# Altium project 新zynq底板.PrjPcb (part 2 of 2)

## Sheet 07_ZYNQ_CAMERALINK.SchDoc
size 420 x 296 mm; SheetNumber: 7; SheetTotal: 7
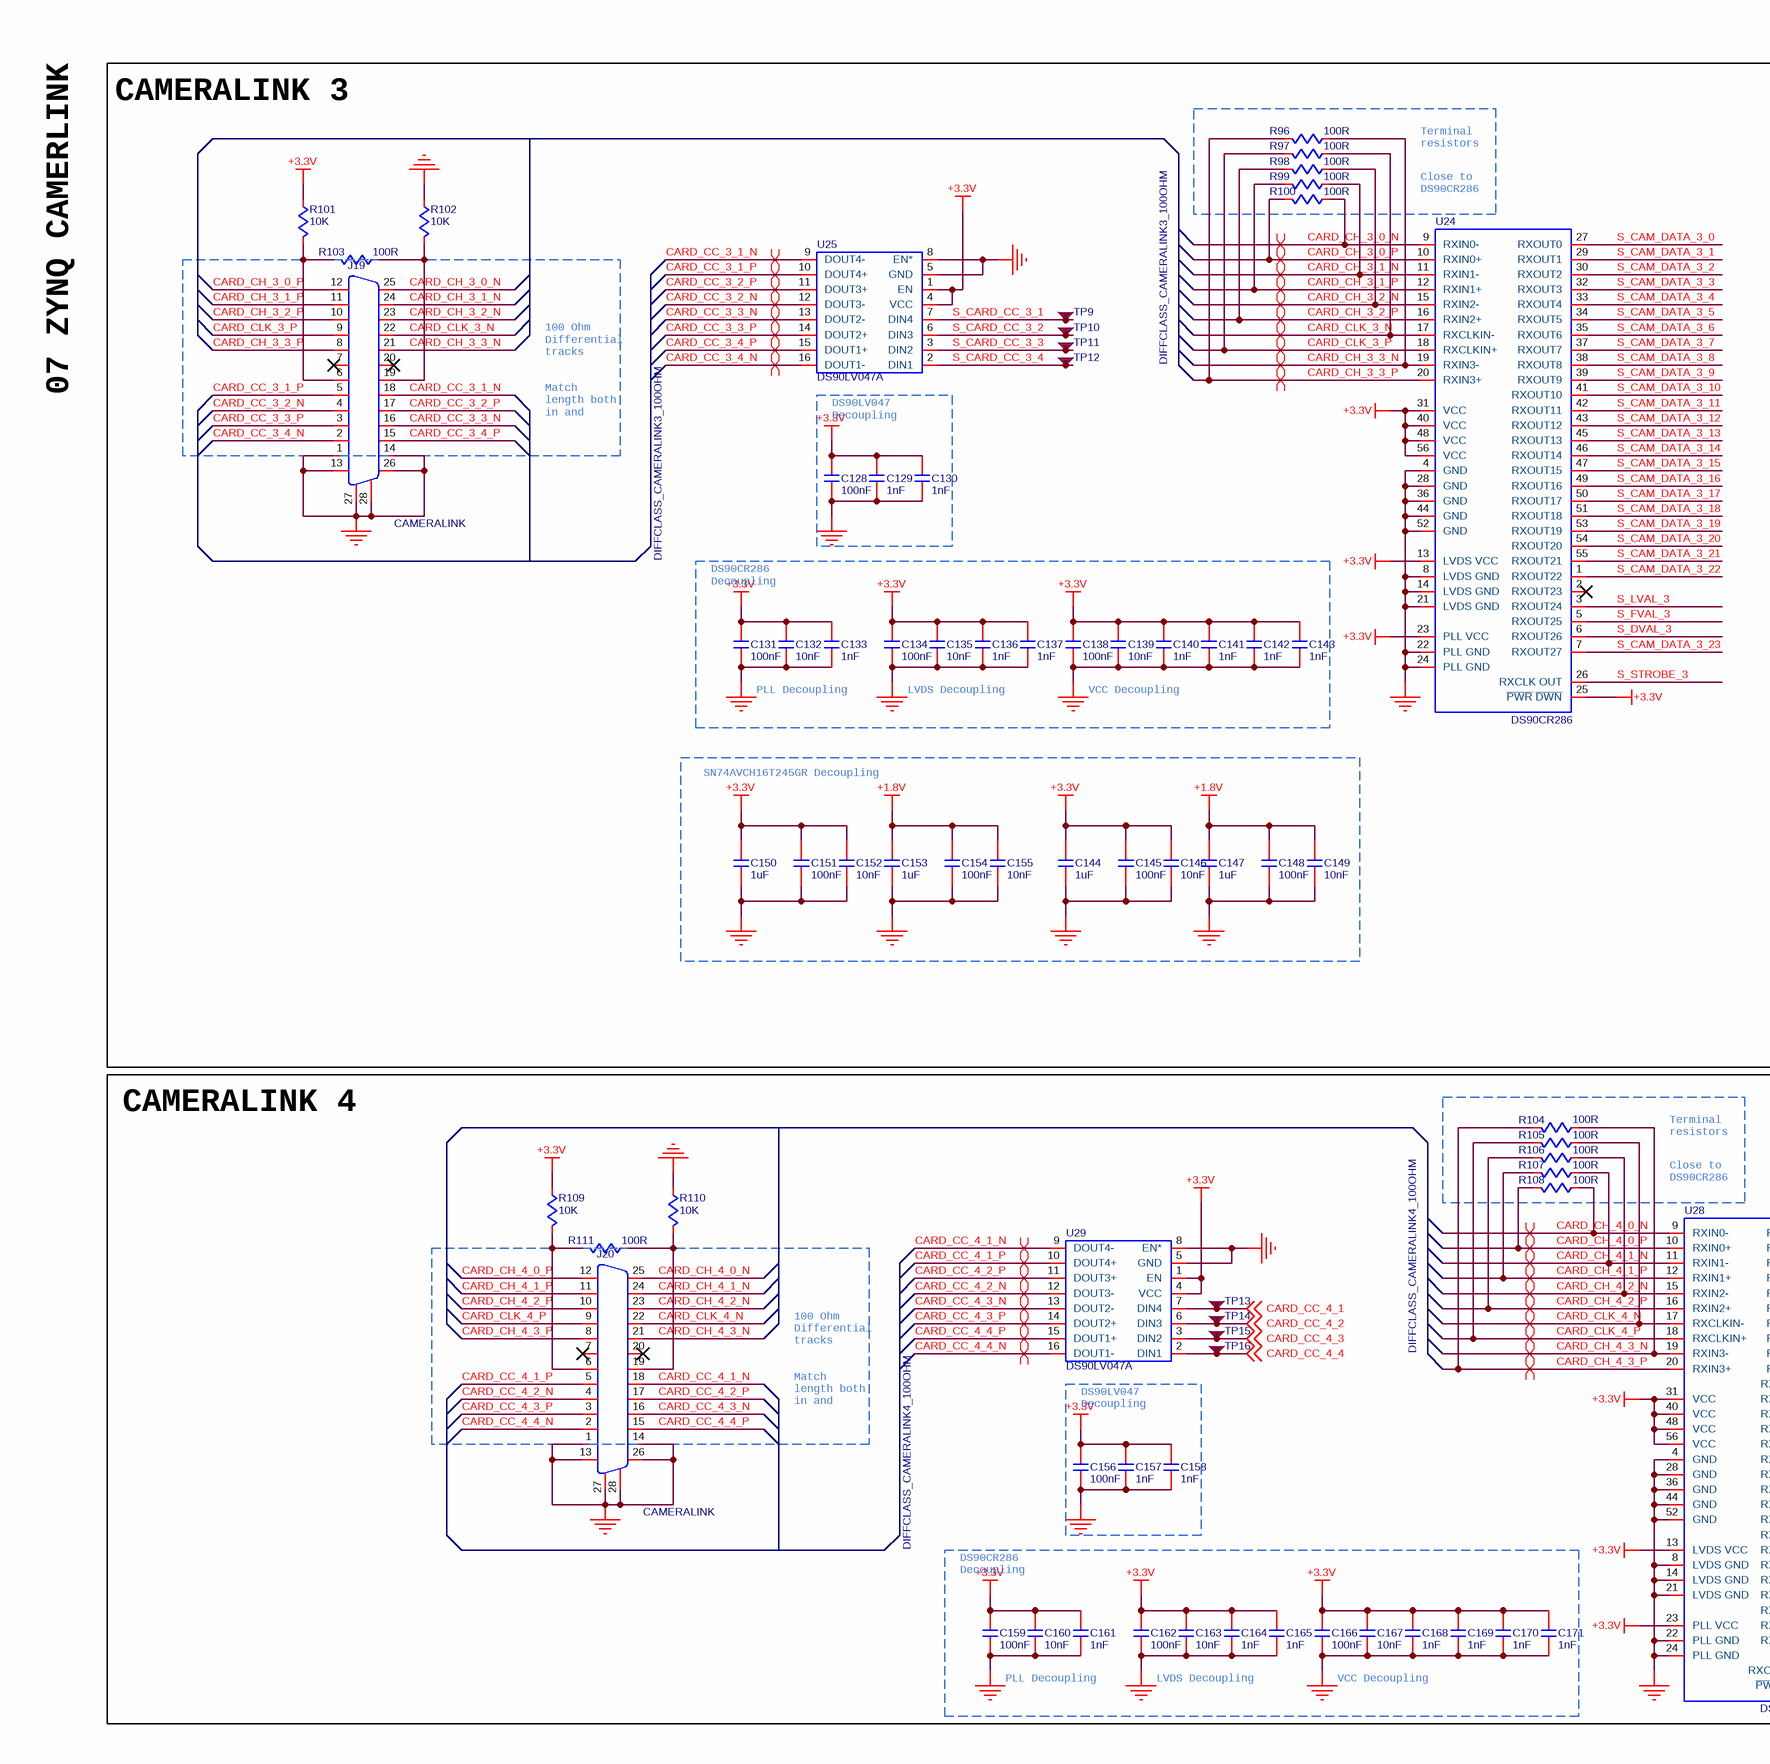
[diagram p10: 07_ZYNQ_CAMERALINK.SchDoc, left]
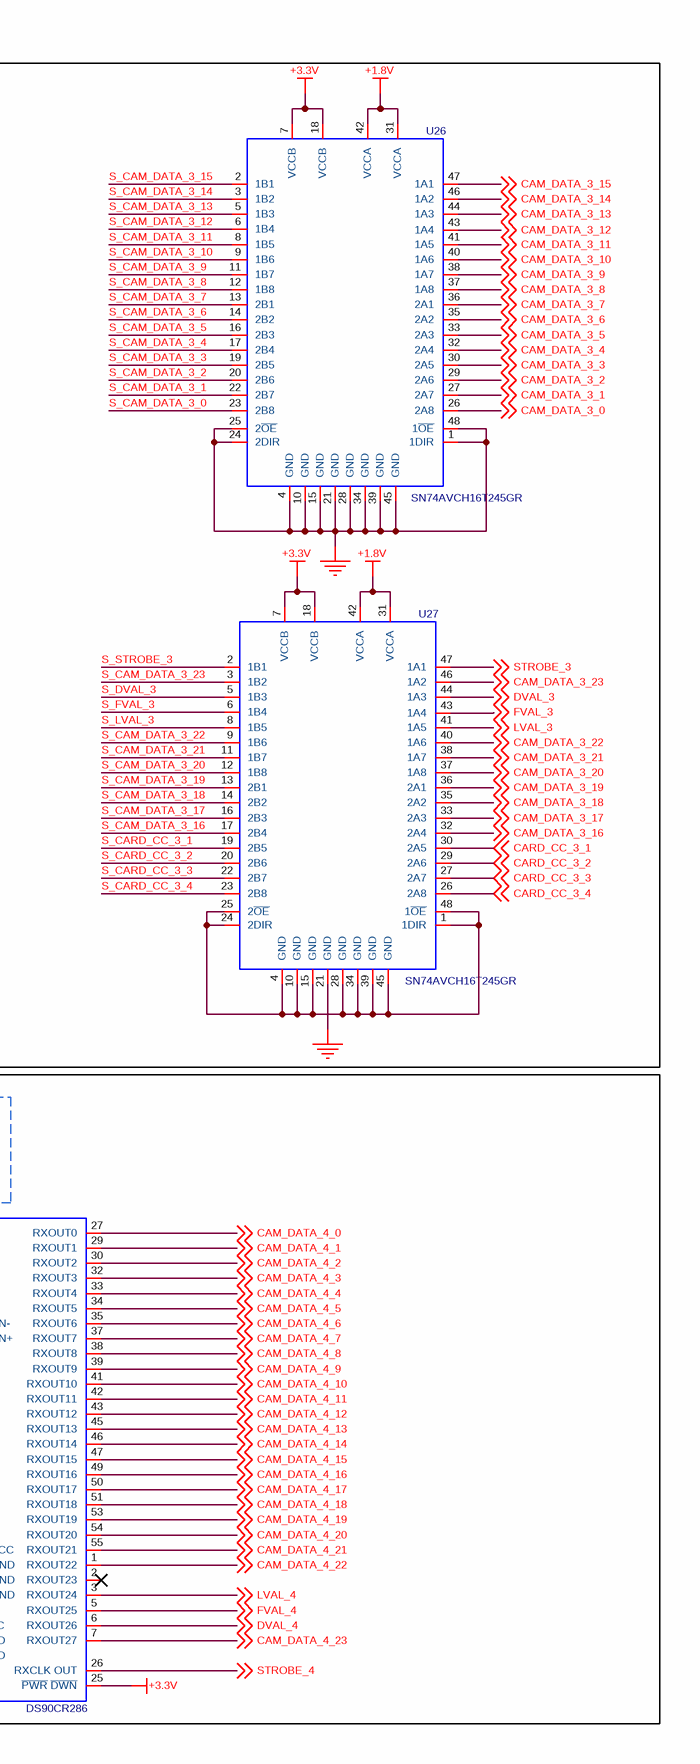
[diagram p11: 07_ZYNQ_CAMERALINK.SchDoc, right]

### Parts
C128  value 100nF  [C0402]  (hidden comment: C-NOMO)
C129  value 1nF  [C0402]  (hidden comment: C-NOMO)
C130  value 1nF  [C0402]  (hidden comment: C-NOMO)
C131  value 100nF  [C0402]  (hidden comment: C-NOMO)
C132  value 10nF  [C0402]  (hidden comment: C-NOMO)
C133  value 1nF  [C0402]  (hidden comment: C-NOMO)
C134  value 100nF  [C0402]  (hidden comment: C-NOMO)
C135  value 10nF  [C0402]  (hidden comment: C-NOMO)
C136  value 1nF  [C0402]  (hidden comment: C-NOMO)
C137  value 1nF  [C0402]  (hidden comment: C-NOMO)
C138  value 100nF  [C0402]  (hidden comment: C-NOMO)
C139  value 10nF  [C0402]  (hidden comment: C-NOMO)
C140  value 1nF  [C0402]  (hidden comment: C-NOMO)
C141  value 1nF  [C0402]  (hidden comment: C-NOMO)
C142  value 1nF  [C0402]  (hidden comment: C-NOMO)
C143  value 1nF  [C0402]  (hidden comment: C-NOMO)
C144  value 1uF  [C0402]  (hidden comment: C-NOMO)
C145  value 100nF  [C0402]  (hidden comment: C-NOMO)
C146  value 10nF  [C0402]  (hidden comment: C-NOMO)
C147  value 1uF  [C0402]  (hidden comment: C-NOMO)
C148  value 100nF  [C0402]  (hidden comment: C-NOMO)
C149  value 10nF  [C0402]  (hidden comment: C-NOMO)
C150  value 1uF  [C0402]  (hidden comment: C-NOMO)
C151  value 100nF  [C0402]  (hidden comment: C-NOMO)
C152  value 10nF  [C0402]  (hidden comment: C-NOMO)
C153  value 1uF  [C0402]  (hidden comment: C-NOMO)
C154  value 100nF  [C0402]  (hidden comment: C-NOMO)
C155  value 10nF  [C0402]  (hidden comment: C-NOMO)
C156  value 100nF  [C0402]  (hidden comment: C-NOMO)
C157  value 1nF  [C0402]  (hidden comment: C-NOMO)
C158  value 1nF  [C0402]  (hidden comment: C-NOMO)
C159  value 100nF  [C0402]  (hidden comment: C-NOMO)
C160  value 10nF  [C0402]  (hidden comment: C-NOMO)
C161  value 1nF  [C0402]  (hidden comment: C-NOMO)
C162  value 100nF  [C0402]  (hidden comment: C-NOMO)
C163  value 10nF  [C0402]  (hidden comment: C-NOMO)
C164  value 1nF  [C0402]  (hidden comment: C-NOMO)
C165  value 1nF  [C0402]  (hidden comment: C-NOMO)
C166  value 100nF  [C0402]  (hidden comment: C-NOMO)
C167  value 10nF  [C0402]  (hidden comment: C-NOMO)
C168  value 1nF  [C0402]  (hidden comment: C-NOMO)
C169  value 1nF  [C0402]  (hidden comment: C-NOMO)
C170  value 1nF  [C0402]  (hidden comment: C-NOMO)
C171  value 1nF  [C0402]  (hidden comment: C-NOMO)
J19  CAMERALINK  [CAMERALINK]
J20  CAMERALINK  [CAMERALINK]
R96  value 100R  [R0402]  (hidden comment: R)
R97  value 100R  [R0402]  (hidden comment: R)
R98  value 100R  [R0402]  (hidden comment: R)
R99  value 100R  [R0402]  (hidden comment: R)
R100  value 100R  [R0402]  (hidden comment: R)
R101  value 10K  [R0402]  (hidden comment: R)
R102  value 10K  [R0402]  (hidden comment: R)
R103  value 100R  [R0402]  (hidden comment: R)
R104  value 100R  [R0402]  (hidden comment: R)
R105  value 100R  [R0402]  (hidden comment: R)
R106  value 100R  [R0402]  (hidden comment: R)
R107  value 100R  [R0402]  (hidden comment: R)
R108  value 100R  [R0402]  (hidden comment: R)
R109  value 10K  [R0402]  (hidden comment: R)
R110  value 10K  [R0402]  (hidden comment: R)
R111  value 100R  [R0402]  (hidden comment: R)
TP9  TP  [TP]  (value not drawn)
TP10  TP  [TP]  (value not drawn)
TP11  TP  [TP]  (value not drawn)
TP12  TP  [TP]  (value not drawn)
TP13  TP  [TP]  (value not drawn)
TP14  TP  [TP]  (value not drawn)
TP15  TP  [TP]  (value not drawn)
TP16  TP  [TP]  (value not drawn)
U24  DS90CR286  [DS90CR286]
U25  DS90LV047A  [DS90LV047]
U26  SN74AVCH16T245GR  [SN74AVCH16T245GR]
U27  SN74AVCH16T245GR  [SN74AVCH16T245GR]
U28  DS90CR286  [DS90CR286]
U29  DS90LV047A  [DS90LV047]

### Blocks framed on the sheet
CAMERALINK 3: C128-C155 J19 R96-R103 TP9-TP12 U24-U27
CAMERALINK 4: C156-C171 J20 R104-R111 TP13-TP16 U28 U29

### Nets
+1.8V: C147.2 C148.2 C149.2 C153.2 C154.2 C155.2 U26.31(VCCA) U26.42(VCCA) U27.31(VCCA) U27.42(VCCA)
+3.3V: C128.2 C129.2 C130.2 C131.2 C132.2 C133.2 C134.2 C135.2 C136.2 C137.2 C138.2 C139.2 C140.2 C141.2 C142.2 C143.2 C144.2 C145.2 C146.2 C150.2 C151.2 C152.2 C156.2 C157.2 C158.2 C159.2 C160.2 C161.2 C162.2 C163.2 C164.2 C165.2 C166.2 C167.2 C168.2 C169.2 C170.2 C171.2 R101.2 R109.2 U24.13(LVDS_VCC) U24.23(PLL_VCC) U24.25(~{PWR}_~{DWN}) U24.31(VCC) U24.40(VCC) U24.48(VCC) U24.56(VCC) U25.1(EN) U25.4(VCC) U26.7(VCCB) U26.18(VCCB) U27.7(VCCB) U27.18(VCCB) U28.13(LVDS_VCC) U28.23(PLL_VCC) U28.25(~{PWR}_~{DWN}) U28.31(VCC) U28.40(VCC) U28.48(VCC) U28.56(VCC) U29.1(EN) U29.4(VCC)
GND: C128.1 C129.1 C130.1 C131.1 C132.1 C133.1 C134.1 C135.1 C136.1 C137.1 C138.1 C139.1 C140.1 C141.1 C142.1 C143.1 C144.1 C145.1 C146.1 C147.1 C148.1 C149.1 C150.1 C151.1 C152.1 C153.1 C154.1 C155.1 C156.1 C157.1 C158.1 C159.1 C160.1 C161.1 C162.1 C163.1 C164.1 C165.1 C166.1 C167.1 C168.1 C169.1 C170.1 C171.1 J19.1 J19.13 J19.14 J19.26 J19.27 J19.28 J20.1 J20.13 J20.14 J20.26 J20.27 J20.28 R102.2 R110.2 U24.4(GND) U24.8(LVDS_GND) U24.14(LVDS_GND) U24.21(LVDS_GND) U24.22(PLL_GND) U24.24(PLL_GND) U24.28(GND) U24.36(GND) U24.44(GND) U24.52(GND) U25.5(GND) U25.8(EN*) U26.1(1DIR) U26.4(GND) U26.10(GND) U26.15(GND) U26.21(GND) U26.24(2DIR) U26.25(2~{OE}) U26.28(GND) U26.34(GND) U26.39(GND) U26.45(GND) U26.48(1~{OE}) U27.21(GND) U28.4(GND) U28.8(LVDS_GND) U28.14(LVDS_GND) U28.21(LVDS_GND) U28.22(PLL_GND) U28.24(PLL_GND) U28.28(GND) U28.36(GND) U28.44(GND) U28.52(GND) U29.5(GND) U29.8(EN*)
CAM_DATA_3_0: U26.26(2A8) ; off-sheet CAM_DATA_3_0
CAM_DATA_3_1: U26.27(2A7) ; off-sheet CAM_DATA_3_1
CAM_DATA_3_2: U26.29(2A6) ; off-sheet CAM_DATA_3_2
CAM_DATA_3_3: U26.30(2A5) ; off-sheet CAM_DATA_3_3
CAM_DATA_3_4: U26.32(2A4) ; off-sheet CAM_DATA_3_4
CAM_DATA_3_5: U26.33(2A3) ; off-sheet CAM_DATA_3_5
CAM_DATA_3_6: U26.35(2A2) ; off-sheet CAM_DATA_3_6
CAM_DATA_3_7: U26.36(2A1) ; off-sheet CAM_DATA_3_7
CAM_DATA_3_8: U26.37(1A8) ; off-sheet CAM_DATA_3_8
CAM_DATA_3_9: U26.38(1A7) ; off-sheet CAM_DATA_3_9
CAM_DATA_3_10: U26.40(1A6) ; off-sheet CAM_DATA_3_10
CAM_DATA_3_11: U26.41(1A5) ; off-sheet CAM_DATA_3_11
CAM_DATA_3_12: U26.43(1A4) ; off-sheet CAM_DATA_3_12
CAM_DATA_3_13: U26.44(1A3) ; off-sheet CAM_DATA_3_13
CAM_DATA_3_14: U26.46(1A2) ; off-sheet CAM_DATA_3_14
CAM_DATA_3_15: U26.47(1A1) ; off-sheet CAM_DATA_3_15
CAM_DATA_3_16: U27.32(2A4) ; off-sheet CAM_DATA_3_16
CAM_DATA_3_17: U27.33(2A3) ; off-sheet CAM_DATA_3_17
CAM_DATA_3_18: U27.35(2A2) ; off-sheet CAM_DATA_3_18
CAM_DATA_3_19: U27.36(2A1) ; off-sheet CAM_DATA_3_19
CAM_DATA_3_20: U27.37(1A8) ; off-sheet CAM_DATA_3_20
CAM_DATA_3_21: U27.38(1A7) ; off-sheet CAM_DATA_3_21
CAM_DATA_3_22: U27.40(1A6) ; off-sheet CAM_DATA_3_22
CAM_DATA_3_23: U27.46(1A2) ; off-sheet CAM_DATA_3_23
CAM_DATA_4_0: U28.27(RXOUT0) ; off-sheet CAM_DATA_4_0
CAM_DATA_4_1: U28.29(RXOUT1) ; off-sheet CAM_DATA_4_1
CAM_DATA_4_2: U28.30(RXOUT2) ; off-sheet CAM_DATA_4_2
CAM_DATA_4_3: U28.32(RXOUT3) ; off-sheet CAM_DATA_4_3
CAM_DATA_4_4: U28.33(RXOUT4) ; off-sheet CAM_DATA_4_4
CAM_DATA_4_5: U28.34(RXOUT5) ; off-sheet CAM_DATA_4_5
CAM_DATA_4_6: U28.35(RXOUT6) ; off-sheet CAM_DATA_4_6
CAM_DATA_4_7: U28.37(RXOUT7) ; off-sheet CAM_DATA_4_7
CAM_DATA_4_8: U28.38(RXOUT8) ; off-sheet CAM_DATA_4_8
CAM_DATA_4_9: U28.39(RXOUT9) ; off-sheet CAM_DATA_4_9
CAM_DATA_4_10: U28.41(RXOUT10) ; off-sheet CAM_DATA_4_10
CAM_DATA_4_11: U28.42(RXOUT11) ; off-sheet CAM_DATA_4_11
CAM_DATA_4_12: U28.43(RXOUT12) ; off-sheet CAM_DATA_4_12
CAM_DATA_4_13: U28.45(RXOUT13) ; off-sheet CAM_DATA_4_13
CAM_DATA_4_14: U28.46(RXOUT14) ; off-sheet CAM_DATA_4_14
CAM_DATA_4_15: U28.47(RXOUT15) ; off-sheet CAM_DATA_4_15
CAM_DATA_4_16: U28.49(RXOUT16) ; off-sheet CAM_DATA_4_16
CAM_DATA_4_17: U28.50(RXOUT17) ; off-sheet CAM_DATA_4_17
CAM_DATA_4_18: U28.51(RXOUT18) ; off-sheet CAM_DATA_4_18
CAM_DATA_4_19: U28.53(RXOUT19) ; off-sheet CAM_DATA_4_19
CAM_DATA_4_20: U28.54(RXOUT20) ; off-sheet CAM_DATA_4_20
CAM_DATA_4_21: U28.55(RXOUT21) ; off-sheet CAM_DATA_4_21
CAM_DATA_4_22: U28.1(RXOUT22) ; off-sheet CAM_DATA_4_22
CAM_DATA_4_23: U28.7(RXOUT27) ; off-sheet CAM_DATA_4_23
CARD_CC_3_1: U27.30(2A5) ; off-sheet CARD_CC_3_1
CARD_CC_3_1_N: J19.18 U25.9(DOUT4-)
CARD_CC_3_1_P: J19.5 U25.10(DOUT4+)
CARD_CC_3_2: U27.29(2A6) ; off-sheet CARD_CC_3_2
CARD_CC_3_2_N: J19.4 U25.12(DOUT3-)
CARD_CC_3_2_P: J19.17 U25.11(DOUT3+)
CARD_CC_3_3: U27.27(2A7) ; off-sheet CARD_CC_3_3
CARD_CC_3_3_N: J19.16 U25.13(DOUT2-)
CARD_CC_3_3_P: J19.3 U25.14(DOUT2+)
CARD_CC_3_4: U27.26(2A8) ; off-sheet CARD_CC_3_4
CARD_CC_3_4_N: J19.2 U25.16(DOUT1-)
CARD_CC_3_4_P: J19.15 U25.15(DOUT1+)
CARD_CC_4_1: TP13.0 U29.7(DIN4) ; off-sheet CARD_CC_4_1
CARD_CC_4_1_N: J20.18 U29.9(DOUT4-)
CARD_CC_4_1_P: J20.5 U29.10(DOUT4+)
CARD_CC_4_2: TP14.0 U29.6(DIN3) ; off-sheet CARD_CC_4_2
CARD_CC_4_2_N: J20.4 U29.12(DOUT3-)
CARD_CC_4_2_P: J20.17 U29.11(DOUT3+)
CARD_CC_4_3: TP15.0 U29.3(DIN2) ; off-sheet CARD_CC_4_3
CARD_CC_4_3_N: J20.16 U29.13(DOUT2-)
CARD_CC_4_3_P: J20.3 U29.14(DOUT2+)
CARD_CC_4_4: TP16.0 U29.2(DIN1) ; off-sheet CARD_CC_4_4
CARD_CC_4_4_N: J20.2 U29.16(DOUT1-)
CARD_CC_4_4_P: J20.15 U29.15(DOUT1+)
CARD_CH_3_0_N: J19.25 R100.2 U24.9(RXIN0-)
CARD_CH_3_0_P: J19.12 R100.1 U24.10(RXIN0+)
CARD_CH_3_1_N: J19.24 R99.2 U24.11(RXIN1-)
CARD_CH_3_1_P: J19.11 R99.1 U24.12(RXIN1+)
CARD_CH_3_2_N: J19.23 R98.2 U24.15(RXIN2-)
CARD_CH_3_2_P: J19.10 R98.1 U24.16(RXIN2+)
CARD_CH_3_3_N: J19.21 R96.2 U24.19(RXIN3-)
CARD_CH_3_3_P: J19.8 R96.1 U24.20(RXIN3+)
CARD_CH_4_0_N: J20.25 R108.2 U28.9(RXIN0-)
CARD_CH_4_0_P: J20.12 R108.1 U28.10(RXIN0+)
CARD_CH_4_1_N: J20.24 R107.2 U28.11(RXIN1-)
CARD_CH_4_1_P: J20.11 R107.1 U28.12(RXIN1+)
CARD_CH_4_2_N: J20.23 R106.2 U28.15(RXIN2-)
CARD_CH_4_2_P: J20.10 R106.1 U28.16(RXIN2+)
CARD_CH_4_3_N: J20.21 R104.2 U28.19(RXIN3-)
CARD_CH_4_3_P: J20.8 R104.1 U28.20(RXIN3+)
CARD_CLK_3_N: J19.22 R97.2 U24.17(RXCLKIN-)
CARD_CLK_3_P: J19.9 R97.1 U24.18(RXCLKIN+)
CARD_CLK_4_N: J20.22 R105.2 U28.17(RXCLKIN-)
CARD_CLK_4_P: J20.9 R105.1 U28.18(RXCLKIN+)
DVAL_3: U27.44(1A3) ; off-sheet DVAL_3
DVAL_4: U28.6(RXOUT26) ; off-sheet DVAL_4
FVAL_3: U27.43(1A4) ; off-sheet FVAL_3
FVAL_4: U28.5(RXOUT25) ; off-sheet FVAL_4
LVAL_3: U27.41(1A5) ; off-sheet LVAL_3
LVAL_4: U28.3(RXOUT24) ; off-sheet LVAL_4
S_CAM_DATA_3_0: U24.27(RXOUT0) U26.23(2B8)
S_CAM_DATA_3_1: U24.29(RXOUT1) U26.22(2B7)
S_CAM_DATA_3_2: U24.30(RXOUT2) U26.20(2B6)
S_CAM_DATA_3_3: U24.32(RXOUT3) U26.19(2B5)
S_CAM_DATA_3_4: U24.33(RXOUT4) U26.17(2B4)
S_CAM_DATA_3_5: U24.34(RXOUT5) U26.16(2B3)
S_CAM_DATA_3_6: U24.35(RXOUT6) U26.14(2B2)
S_CAM_DATA_3_7: U24.37(RXOUT7) U26.13(2B1)
S_CAM_DATA_3_8: U24.38(RXOUT8) U26.12(1B8)
S_CAM_DATA_3_9: U24.39(RXOUT9) U26.11(1B7)
S_CAM_DATA_3_10: U24.41(RXOUT10) U26.9(1B6)
S_CAM_DATA_3_11: U24.42(RXOUT11) U26.8(1B5)
S_CAM_DATA_3_12: U24.43(RXOUT12) U26.6(1B4)
S_CAM_DATA_3_13: U24.45(RXOUT13) U26.5(1B3)
S_CAM_DATA_3_14: U24.46(RXOUT14) U26.3(1B2)
S_CAM_DATA_3_15: U24.47(RXOUT15) U26.2(1B1)
S_CAM_DATA_3_16: U24.49(RXOUT16) U27.17(2B4)
S_CAM_DATA_3_17: U24.50(RXOUT17) U27.16(2B3)
S_CAM_DATA_3_18: U24.51(RXOUT18) U27.14(2B2)
S_CAM_DATA_3_19: U24.53(RXOUT19) U27.13(2B1)
S_CAM_DATA_3_20: U24.54(RXOUT20) U27.12(1B8)
S_CAM_DATA_3_21: U24.55(RXOUT21) U27.11(1B7)
S_CAM_DATA_3_22: U24.1(RXOUT22) U27.9(1B6)
S_CAM_DATA_3_23: U24.7(RXOUT27) U27.3(1B2)
S_CARD_CC_3_1: TP9.0 U25.7(DIN4) U27.19(2B5)
S_CARD_CC_3_2: TP10.0 U25.6(DIN3) U27.20(2B6)
S_CARD_CC_3_3: TP11.0 U25.3(DIN2) U27.22(2B7)
S_CARD_CC_3_4: TP12.0 U25.2(DIN1) U27.23(2B8)
S_DVAL_3: U24.6(RXOUT26) U27.5(1B3)
S_FVAL_3: U24.5(RXOUT25) U27.6(1B4)
S_LVAL_3: U24.3(RXOUT24) U27.8(1B5)
S_STROBE_3: U24.26(RXCLK_OUT) U27.2(1B1)
STROBE_3: U27.47(1A1) ; off-sheet STROBE_3
STROBE_4: U28.26(RXCLK_OUT) ; off-sheet STROBE_4
NetJ19_6: J19.6 R101.1 R103.1
NetJ19_19: J19.19 R102.1 R103.2
NetJ20_6: J20.6 R109.1 R111.1
NetJ20_19: J20.19 R110.1 R111.2
NetU27_1: U27.1(1DIR) U27.4(GND) U27.10(GND) U27.15(GND) U27.24(2DIR) U27.25(2~{OE}) U27.28(GND) U27.34(GND) U27.39(GND) U27.45(GND) U27.48(1~{OE})

Not connected (* = marked no-connect by the designer): J19 7* 20*; J20 7* 20*; U24 2(RXOUT23)*; U28 2(RXOUT23)*

### Layout directives
differential pair; differential pair class DIFFCLASS_CAMERALINK4_100OHM: CARD_CC_4_1_N, CARD_CC_4_1_P, CARD_CC_4_2_N, CARD_CC_4_2_P, CARD_CC_4_3_N, CARD_CC_4_3_P, CARD_CC_4_4_N, CARD_CC_4_4_P, CARD_CH_4_0_N, CARD_CH_4_0_P, CARD_CH_4_1_N, CARD_CH_4_1_P, CARD_CH_4_2_N, CARD_CH_4_2_P, CARD_CH_4_3_N, CARD_CH_4_3_P, CARD_CLK_4_N, CARD_CLK_4_P
differential pair; differential pair class DIFFCLASS_CAMERALINK3_100OHM: CARD_CC_3_1_N, CARD_CC_3_1_P, CARD_CC_3_2_N, CARD_CC_3_2_P, CARD_CC_3_3_N, CARD_CC_3_3_P, CARD_CC_3_4_N, CARD_CC_3_4_P, CARD_CH_3_0_N, CARD_CH_3_0_P, CARD_CH_3_1_N, CARD_CH_3_1_P, CARD_CH_3_2_N, CARD_CH_3_2_P, CARD_CH_3_3_N, CARD_CH_3_3_P, CARD_CLK_3_N, CARD_CLK_3_P

### Notes on the sheet
- Terminal resistors
- (near U24) Close to DS90CR286
- 07 ZYNQ CAMERLINK
- 100 Ohm Differential tracks
  Match length both in and between pairs
- DS90LV047 Decoupling
- DS90CR286 Decoupling
- PLL Decoupling
- LVDS Decoupling
- VCC Decoupling
- SN74AVCH16T245GR Decoupling
- (near U28) Close to DS90CR286

### Library data of the parts
C128-C171 = C-NOMO: voltage: 25V; precision: 5%
R96-R111 = R: precision: 1%

## Nets that join several sheets
+1.2V: 01_ZYNQ_POWER (8 pins), 05_ZYNQ_ETHERNET (14 pins)
+1.8V: 01_ZYNQ_POWER (8 pins), 03_ZYNQ_JTAG_BOOT (C44.2 U5.5), 04_ZYNQ_MISC_INTERFACE (7 pins), 05_ZYNQ_ETHERNET (17 pins), 07_ZYNQ_CAMERALINK (10 pins)
+3.3V: 01_ZYNQ_POWER (9 pins), 03_ZYNQ_JTAG_BOOT (31 pins), 04_ZYNQ_MISC_INTERFACE (30 pins), 05_ZYNQ_ETHERNET (6 pins), 06_ZYNQ_CAMERALINK (52 pins), 07_ZYNQ_CAMERALINK (62 pins)
+5V: 01_ZYNQ_POWER (5 pins), 02_ZYNQ_CORE_POS (14 pins)
GND: 01_ZYNQ_POWER (53 pins), 02_ZYNQ_CORE_POS (154 pins), 03_ZYNQ_JTAG_BOOT (38 pins), 04_ZYNQ_MISC_INTERFACE (59 pins), 05_ZYNQ_ETHERNET (38 pins), 06_ZYNQ_CAMERALINK (70 pins), 07_ZYNQ_CAMERALINK (95 pins)
AUART2_RX: 02_ZYNQ_CORE_POS (J6.40), 04_ZYNQ_MISC_INTERFACE (U12.3)
AUART2_TX: 02_ZYNQ_CORE_POS (J6.62), 04_ZYNQ_MISC_INTERFACE (U8.3)
CAM_DATA_1_0: 02_ZYNQ_CORE_POS (J3.20), 06_ZYNQ_CAMERALINK (U20.27)
CAM_DATA_1_1: 02_ZYNQ_CORE_POS (J3.43), 06_ZYNQ_CAMERALINK (U20.29)
CAM_DATA_1_2: 02_ZYNQ_CORE_POS (J3.39), 06_ZYNQ_CAMERALINK (U20.30)
CAM_DATA_1_3: 02_ZYNQ_CORE_POS (J3.37), 06_ZYNQ_CAMERALINK (U20.32)
CAM_DATA_1_4: 02_ZYNQ_CORE_POS (J3.33), 06_ZYNQ_CAMERALINK (U20.33)
CAM_DATA_1_5: 02_ZYNQ_CORE_POS (J3.31), 06_ZYNQ_CAMERALINK (U20.34)
CAM_DATA_1_6: 02_ZYNQ_CORE_POS (J3.27), 06_ZYNQ_CAMERALINK (U20.35)
CAM_DATA_1_7: 02_ZYNQ_CORE_POS (J3.25), 06_ZYNQ_CAMERALINK (U20.37)
CAM_DATA_1_8: 02_ZYNQ_CORE_POS (J3.21), 06_ZYNQ_CAMERALINK (U20.38)
CAM_DATA_1_9: 02_ZYNQ_CORE_POS (J3.19), 06_ZYNQ_CAMERALINK (U20.39)
CAM_DATA_1_10: 02_ZYNQ_CORE_POS (J3.15), 06_ZYNQ_CAMERALINK (U20.41)
CAM_DATA_1_11: 02_ZYNQ_CORE_POS (J3.13), 06_ZYNQ_CAMERALINK (U20.42)
CAM_DATA_1_12: 02_ZYNQ_CORE_POS (J3.9), 06_ZYNQ_CAMERALINK (U20.43)
CAM_DATA_1_13: 02_ZYNQ_CORE_POS (J3.7), 06_ZYNQ_CAMERALINK (U20.45)
CAM_DATA_1_14: 02_ZYNQ_CORE_POS (J3.3), 06_ZYNQ_CAMERALINK (U20.46)
CAM_DATA_1_15: 02_ZYNQ_CORE_POS (J3.1), 06_ZYNQ_CAMERALINK (U20.47)
CAM_DATA_1_16: 02_ZYNQ_CORE_POS (J3.2), 06_ZYNQ_CAMERALINK (U20.49)
CAM_DATA_1_17: 02_ZYNQ_CORE_POS (J3.4), 06_ZYNQ_CAMERALINK (U20.50)
CAM_DATA_1_18: 02_ZYNQ_CORE_POS (J3.8), 06_ZYNQ_CAMERALINK (U20.51)
CAM_DATA_1_19: 02_ZYNQ_CORE_POS (J3.10), 06_ZYNQ_CAMERALINK (U20.53)
CAM_DATA_1_20: 02_ZYNQ_CORE_POS (J3.14), 06_ZYNQ_CAMERALINK (U20.54)
CAM_DATA_1_21: 02_ZYNQ_CORE_POS (J3.16), 06_ZYNQ_CAMERALINK (U20.55)
CAM_DATA_1_22: 02_ZYNQ_CORE_POS (J3.38), 06_ZYNQ_CAMERALINK (U20.1)
CAM_DATA_1_23: 02_ZYNQ_CORE_POS (J3.26), 06_ZYNQ_CAMERALINK (U20.7)
CAM_DATA_2_0: 02_ZYNQ_CORE_POS (J3.118), 06_ZYNQ_CAMERALINK (U22.27)
CAM_DATA_2_1: 02_ZYNQ_CORE_POS (J3.105), 06_ZYNQ_CAMERALINK (U22.29)
CAM_DATA_2_2: 02_ZYNQ_CORE_POS (J3.103), 06_ZYNQ_CAMERALINK (U22.30)
CAM_DATA_2_3: 02_ZYNQ_CORE_POS (J3.99), 06_ZYNQ_CAMERALINK (U22.32)
CAM_DATA_2_4: 02_ZYNQ_CORE_POS (J3.97), 06_ZYNQ_CAMERALINK (U22.33)
CAM_DATA_2_5: 02_ZYNQ_CORE_POS (J3.93), 06_ZYNQ_CAMERALINK (U22.34)
CAM_DATA_2_6: 02_ZYNQ_CORE_POS (J3.91), 06_ZYNQ_CAMERALINK (U22.35)
CAM_DATA_2_7: 02_ZYNQ_CORE_POS (J3.87), 06_ZYNQ_CAMERALINK (U22.37)
CAM_DATA_2_8: 02_ZYNQ_CORE_POS (J3.85), 06_ZYNQ_CAMERALINK (U22.38)
CAM_DATA_2_9: 02_ZYNQ_CORE_POS (J3.81), 06_ZYNQ_CAMERALINK (U22.39)
CAM_DATA_2_10: 02_ZYNQ_CORE_POS (J3.79), 06_ZYNQ_CAMERALINK (U22.41)
CAM_DATA_2_11: 02_ZYNQ_CORE_POS (J3.75), 06_ZYNQ_CAMERALINK (U22.42)
CAM_DATA_2_12: 02_ZYNQ_CORE_POS (J3.73), 06_ZYNQ_CAMERALINK (U22.43)
CAM_DATA_2_13: 02_ZYNQ_CORE_POS (J3.69), 06_ZYNQ_CAMERALINK (U22.45)
CAM_DATA_2_14: 02_ZYNQ_CORE_POS (J3.67), 06_ZYNQ_CAMERALINK (U22.46)
CAM_DATA_2_15: 02_ZYNQ_CORE_POS (J3.63), 06_ZYNQ_CAMERALINK (U22.47)
CAM_DATA_2_16: 02_ZYNQ_CORE_POS (J3.61), 06_ZYNQ_CAMERALINK (U22.49)
CAM_DATA_2_17: 02_ZYNQ_CORE_POS (J3.57), 06_ZYNQ_CAMERALINK (U22.50)
CAM_DATA_2_18: 02_ZYNQ_CORE_POS (J3.55), 06_ZYNQ_CAMERALINK (U22.51)
CAM_DATA_2_19: 02_ZYNQ_CORE_POS (J3.51), 06_ZYNQ_CAMERALINK (U22.53)
CAM_DATA_2_20: 02_ZYNQ_CORE_POS (J3.49), 06_ZYNQ_CAMERALINK (U22.54)
CAM_DATA_2_21: 02_ZYNQ_CORE_POS (J3.45), 06_ZYNQ_CAMERALINK (U22.55)
CAM_DATA_2_22: 02_ZYNQ_CORE_POS (J3.70), 06_ZYNQ_CAMERALINK (U22.1)
CAM_DATA_2_23: 02_ZYNQ_CORE_POS (J3.82), 06_ZYNQ_CAMERALINK (U22.7)
CAM_DATA_3_0: 02_ZYNQ_CORE_POS (J5.52), 07_ZYNQ_CAMERALINK (U26.26)
CAM_DATA_3_1: 02_ZYNQ_CORE_POS (J5.50), 07_ZYNQ_CAMERALINK (U26.27)
CAM_DATA_3_2: 02_ZYNQ_CORE_POS (J5.46), 07_ZYNQ_CAMERALINK (U26.29)
CAM_DATA_3_3: 02_ZYNQ_CORE_POS (J5.44), 07_ZYNQ_CAMERALINK (U26.30)
CAM_DATA_3_4: 02_ZYNQ_CORE_POS (J5.40), 07_ZYNQ_CAMERALINK (U26.32)
CAM_DATA_3_5: 02_ZYNQ_CORE_POS (J5.38), 07_ZYNQ_CAMERALINK (U26.33)
CAM_DATA_3_6: 02_ZYNQ_CORE_POS (J5.34), 07_ZYNQ_CAMERALINK (U26.35)
CAM_DATA_3_7: 02_ZYNQ_CORE_POS (J5.32), 07_ZYNQ_CAMERALINK (U26.36)
CAM_DATA_3_8: 02_ZYNQ_CORE_POS (J5.28), 07_ZYNQ_CAMERALINK (U26.37)
CAM_DATA_3_9: 02_ZYNQ_CORE_POS (J5.26), 07_ZYNQ_CAMERALINK (U26.38)
CAM_DATA_3_10: 02_ZYNQ_CORE_POS (J5.22), 07_ZYNQ_CAMERALINK (U26.40)
CAM_DATA_3_11: 02_ZYNQ_CORE_POS (J5.20), 07_ZYNQ_CAMERALINK (U26.41)
CAM_DATA_3_12: 02_ZYNQ_CORE_POS (J5.16), 07_ZYNQ_CAMERALINK (U26.43)
CAM_DATA_3_13: 02_ZYNQ_CORE_POS (J5.14), 07_ZYNQ_CAMERALINK (U26.44)
CAM_DATA_3_14: 02_ZYNQ_CORE_POS (J5.10), 07_ZYNQ_CAMERALINK (U26.46)
CAM_DATA_3_15: 02_ZYNQ_CORE_POS (J5.8), 07_ZYNQ_CAMERALINK (U26.47)
CAM_DATA_3_16: 02_ZYNQ_CORE_POS (J5.7), 07_ZYNQ_CAMERALINK (U27.32)
CAM_DATA_3_17: 02_ZYNQ_CORE_POS (J5.9), 07_ZYNQ_CAMERALINK (U27.33)
CAM_DATA_3_18: 02_ZYNQ_CORE_POS (J5.13), 07_ZYNQ_CAMERALINK (U27.35)
CAM_DATA_3_19: 02_ZYNQ_CORE_POS (J5.15), 07_ZYNQ_CAMERALINK (U27.36)
CAM_DATA_3_20: 02_ZYNQ_CORE_POS (J5.19), 07_ZYNQ_CAMERALINK (U27.37)
CAM_DATA_3_21: 02_ZYNQ_CORE_POS (J5.21), 07_ZYNQ_CAMERALINK (U27.38)
CAM_DATA_3_22: 02_ZYNQ_CORE_POS (J5.25), 07_ZYNQ_CAMERALINK (U27.40)
CAM_DATA_3_23: 02_ZYNQ_CORE_POS (J5.37), 07_ZYNQ_CAMERALINK (U27.46)
CAM_DATA_4_0: 02_ZYNQ_CORE_POS (J6.74), 07_ZYNQ_CAMERALINK (U28.27)
CAM_DATA_4_1: 02_ZYNQ_CORE_POS (J6.76), 07_ZYNQ_CAMERALINK (U28.29)
CAM_DATA_4_2: 02_ZYNQ_CORE_POS (J6.80), 07_ZYNQ_CAMERALINK (U28.30)
CAM_DATA_4_3: 02_ZYNQ_CORE_POS (J6.82), 07_ZYNQ_CAMERALINK (U28.32)
CAM_DATA_4_4: 02_ZYNQ_CORE_POS (J6.86), 07_ZYNQ_CAMERALINK (U28.33)
CAM_DATA_4_5: 02_ZYNQ_CORE_POS (J6.88), 07_ZYNQ_CAMERALINK (U28.34)
CAM_DATA_4_6: 02_ZYNQ_CORE_POS (J6.92), 07_ZYNQ_CAMERALINK (U28.35)
CAM_DATA_4_7: 02_ZYNQ_CORE_POS (J6.94), 07_ZYNQ_CAMERALINK (U28.37)
CAM_DATA_4_8: 02_ZYNQ_CORE_POS (J6.43), 07_ZYNQ_CAMERALINK (U28.38)
CAM_DATA_4_9: 02_ZYNQ_CORE_POS (J6.45), 07_ZYNQ_CAMERALINK (U28.39)
CAM_DATA_4_10: 02_ZYNQ_CORE_POS (J6.49), 07_ZYNQ_CAMERALINK (U28.41)
CAM_DATA_4_11: 02_ZYNQ_CORE_POS (J6.51), 07_ZYNQ_CAMERALINK (U28.42)
CAM_DATA_4_12: 02_ZYNQ_CORE_POS (J6.55), 07_ZYNQ_CAMERALINK (U28.43)
CAM_DATA_4_13: 02_ZYNQ_CORE_POS (J6.57), 07_ZYNQ_CAMERALINK (U28.45)
CAM_DATA_4_14: 02_ZYNQ_CORE_POS (J6.61), 07_ZYNQ_CAMERALINK (U28.46)
CAM_DATA_4_15: 02_ZYNQ_CORE_POS (J6.63), 07_ZYNQ_CAMERALINK (U28.47)
CAM_DATA_4_16: 02_ZYNQ_CORE_POS (J6.67), 07_ZYNQ_CAMERALINK (U28.49)
CAM_DATA_4_17: 02_ZYNQ_CORE_POS (J6.69), 07_ZYNQ_CAMERALINK (U28.50)
CAM_DATA_4_18: 02_ZYNQ_CORE_POS (J6.73), 07_ZYNQ_CAMERALINK (U28.51)
CAM_DATA_4_19: 02_ZYNQ_CORE_POS (J6.75), 07_ZYNQ_CAMERALINK (U28.53)
CAM_DATA_4_20: 02_ZYNQ_CORE_POS (J6.79), 07_ZYNQ_CAMERALINK (U28.54)
CAM_DATA_4_21: 02_ZYNQ_CORE_POS (J6.81), 07_ZYNQ_CAMERALINK (U28.55)
CAM_DATA_4_22: 02_ZYNQ_CORE_POS (J6.85), 07_ZYNQ_CAMERALINK (U28.1)
CAM_DATA_4_23: 02_ZYNQ_CORE_POS (J6.103), 07_ZYNQ_CAMERALINK (U28.7)
CARD_CC_1_1: 02_ZYNQ_CORE_POS (J3.40), 06_ZYNQ_CAMERALINK (TP1.0 U21.7)
CARD_CC_1_2: 02_ZYNQ_CORE_POS (J3.44), 06_ZYNQ_CAMERALINK (TP2.0 U21.6)
CARD_CC_1_3: 02_ZYNQ_CORE_POS (J3.46), 06_ZYNQ_CAMERALINK (TP3.0 U21.3)
CARD_CC_1_4: 02_ZYNQ_CORE_POS (J3.50), 06_ZYNQ_CAMERALINK (TP4.0 U21.2)
CARD_CC_2_1: 02_ZYNQ_CORE_POS (J3.109), 06_ZYNQ_CAMERALINK (TP5.0 U23.7)
CARD_CC_2_2: 02_ZYNQ_CORE_POS (J3.111), 06_ZYNQ_CAMERALINK (TP6.0 U23.6)
CARD_CC_2_3: 02_ZYNQ_CORE_POS (J3.115), 06_ZYNQ_CAMERALINK (TP7.0 U23.3)
CARD_CC_2_4: 02_ZYNQ_CORE_POS (J3.117), 06_ZYNQ_CAMERALINK (TP8.0 U23.2)
CARD_CC_3_1: 02_ZYNQ_CORE_POS (J5.62), 07_ZYNQ_CAMERALINK (U27.30)
CARD_CC_3_2: 02_ZYNQ_CORE_POS (J5.64), 07_ZYNQ_CAMERALINK (U27.29)
CARD_CC_3_3: 02_ZYNQ_CORE_POS (J5.56), 07_ZYNQ_CAMERALINK (U27.27)
CARD_CC_3_4: 02_ZYNQ_CORE_POS (J5.58), 07_ZYNQ_CAMERALINK (U27.26)
CARD_CC_4_1: 02_ZYNQ_CORE_POS (J6.98), 07_ZYNQ_CAMERALINK (TP13.0 U29.7)
CARD_CC_4_2: 02_ZYNQ_CORE_POS (J6.100), 07_ZYNQ_CAMERALINK (TP14.0 U29.6)
CARD_CC_4_3: 02_ZYNQ_CORE_POS (J6.104), 07_ZYNQ_CAMERALINK (TP15.0 U29.3)
CARD_CC_4_4: 02_ZYNQ_CORE_POS (J6.106), 07_ZYNQ_CAMERALINK (TP16.0 U29.2)
DVAL_1: 02_ZYNQ_CORE_POS (J3.28), 06_ZYNQ_CAMERALINK (U20.6)
DVAL_2: 02_ZYNQ_CORE_POS (J3.80), 06_ZYNQ_CAMERALINK (U22.6)
DVAL_3: 02_ZYNQ_CORE_POS (J5.33), 07_ZYNQ_CAMERALINK (U27.44)
DVAL_4: 02_ZYNQ_CORE_POS (J6.99), 07_ZYNQ_CAMERALINK (U28.6)
ENCODER_1: 02_ZYNQ_CORE_POS (J3.94), 04_ZYNQ_MISC_INTERFACE (R53.1 U7.7)
ENCODER_2: 02_ZYNQ_CORE_POS (J3.106), 04_ZYNQ_MISC_INTERFACE (R54.1 U7.6)
FAN_PWM: 01_ZYNQ_POWER (R4.1), 02_ZYNQ_CORE_POS (J5.81)
FPGA_TCK: 02_ZYNQ_CORE_POS (J5.1), 03_ZYNQ_JTAG_BOOT (Q6.3 R24.1)
FPGA_TDI: 02_ZYNQ_CORE_POS (J5.2), 03_ZYNQ_JTAG_BOOT (Q9.3 R30.1)
FPGA_TDO: 02_ZYNQ_CORE_POS (J5.4), 03_ZYNQ_JTAG_BOOT (Q7.3 R25.1)
FPGA_TMS: 02_ZYNQ_CORE_POS (J5.3), 03_ZYNQ_JTAG_BOOT (Q8.3 R26.1)
FPGA_TXD_1_1: 02_ZYNQ_CORE_POS (J3.68), 04_ZYNQ_MISC_INTERFACE (U9.2)
FPGA_TXD_1_2: 02_ZYNQ_CORE_POS (J3.64), 04_ZYNQ_MISC_INTERFACE (U9.3)
FPGA_TXD_1_3: 02_ZYNQ_CORE_POS (J3.62), 04_ZYNQ_MISC_INTERFACE (U9.6)
FPGA_TXD_1_4: 02_ZYNQ_CORE_POS (J3.58), 04_ZYNQ_MISC_INTERFACE (U9.7)
FPGA_TXD_1_5: 02_ZYNQ_CORE_POS (J3.56), 04_ZYNQ_MISC_INTERFACE (U10.2)
FPGA_TXD_1_6: 02_ZYNQ_CORE_POS (J3.52), 04_ZYNQ_MISC_INTERFACE (U10.3)
FPGA_TXD_1_7: 02_ZYNQ_CORE_POS (J3.110), 04_ZYNQ_MISC_INTERFACE (U10.6)
FPGA_TXD_1_8: 02_ZYNQ_CORE_POS (J3.112), 04_ZYNQ_MISC_INTERFACE (U10.7)
FPGA_TXD_1_9: 02_ZYNQ_CORE_POS (J6.91), 04_ZYNQ_MISC_INTERFACE (U11.2)
FVAL_1: 02_ZYNQ_CORE_POS (J3.32), 06_ZYNQ_CAMERALINK (U20.5)
FVAL_2: 02_ZYNQ_CORE_POS (J3.76), 06_ZYNQ_CAMERALINK (U22.5)
FVAL_3: 02_ZYNQ_CORE_POS (J5.31), 07_ZYNQ_CAMERALINK (U27.43)
FVAL_4: 02_ZYNQ_CORE_POS (J6.97), 07_ZYNQ_CAMERALINK (U28.5)
LVAL_1: 02_ZYNQ_CORE_POS (J3.34), 06_ZYNQ_CAMERALINK (U20.3)
LVAL_2: 02_ZYNQ_CORE_POS (J3.74), 06_ZYNQ_CAMERALINK (U22.3)
LVAL_3: 02_ZYNQ_CORE_POS (J5.27), 07_ZYNQ_CAMERALINK (U27.41)
LVAL_4: 02_ZYNQ_CORE_POS (J6.87), 07_ZYNQ_CAMERALINK (U28.3)
PHY1_MDC: 02_ZYNQ_CORE_POS (J6.13), 05_ZYNQ_ETHERNET (U19.36)
PHY1_MDIO: 02_ZYNQ_CORE_POS (J6.15), 05_ZYNQ_ETHERNET (R74.1 U19.37)
PHY1_RXCK: 02_ZYNQ_CORE_POS (J6.34), 05_ZYNQ_ETHERNET (R79.2 U19.35)
PHY1_RXCTL: 02_ZYNQ_CORE_POS (J6.32), 05_ZYNQ_ETHERNET (R72.1 U19.33)
PHY1_RXD0: 02_ZYNQ_CORE_POS (J6.28), 05_ZYNQ_ETHERNET (R68.1 U19.32)
PHY1_RXD1: 02_ZYNQ_CORE_POS (J6.26), 05_ZYNQ_ETHERNET (R69.1 U19.31)
PHY1_RXD2: 02_ZYNQ_CORE_POS (J6.22), 05_ZYNQ_ETHERNET (R70.1 U19.28)
PHY1_RXD3: 02_ZYNQ_CORE_POS (J6.20), 05_ZYNQ_ETHERNET (R71.1 U19.27)
PHY1_TXCK: 02_ZYNQ_CORE_POS (J6.14), 05_ZYNQ_ETHERNET (U19.24)
PHY1_TXCTL: 02_ZYNQ_CORE_POS (J6.16), 05_ZYNQ_ETHERNET (U19.25)
PHY1_TXD0: 02_ZYNQ_CORE_POS (J6.2), 05_ZYNQ_ETHERNET (U19.19)
PHY1_TXD1: 02_ZYNQ_CORE_POS (J6.4), 05_ZYNQ_ETHERNET (U19.20)
PHY1_TXD2: 02_ZYNQ_CORE_POS (J6.8), 05_ZYNQ_ETHERNET (U19.21)
PHY1_TXD3: 02_ZYNQ_CORE_POS (J6.10), 05_ZYNQ_ETHERNET (U19.22)
PL_KEY1: 02_ZYNQ_CORE_POS (J3.98), 03_ZYNQ_JTAG_BOOT (R48.2)
PL_KEY2: 02_ZYNQ_CORE_POS (J3.100), 03_ZYNQ_JTAG_BOOT (R51.2)
PL_KEY3: 02_ZYNQ_CORE_POS (J3.104), 03_ZYNQ_JTAG_BOOT (R52.2)
PL_LED1: 02_ZYNQ_CORE_POS (J3.86), 03_ZYNQ_JTAG_BOOT (R31.2)
PL_LED2: 02_ZYNQ_CORE_POS (J3.88), 03_ZYNQ_JTAG_BOOT (R32.2)
PL_LED3: 02_ZYNQ_CORE_POS (J3.92), 03_ZYNQ_JTAG_BOOT (R33.2)
PS_MIO4: 02_ZYNQ_CORE_POS (J6.3), 03_ZYNQ_JTAG_BOOT (R42.2)
PS_MIO5: 02_ZYNQ_CORE_POS (J6.1), 03_ZYNQ_JTAG_BOOT (R41.2)
PS_POR_B: 02_ZYNQ_CORE_POS (J5.115), 05_ZYNQ_ETHERNET (D4.1)
SD_CLK: 02_ZYNQ_CORE_POS (J6.25), 03_ZYNQ_JTAG_BOOT (U5.9)
SD_CMD: 02_ZYNQ_CORE_POS (J6.27), 03_ZYNQ_JTAG_BOOT (U5.4)
SD_D0: 02_ZYNQ_CORE_POS (J6.31), 03_ZYNQ_JTAG_BOOT (U5.6)
SD_D1: 02_ZYNQ_CORE_POS (J6.33), 03_ZYNQ_JTAG_BOOT (U5.7)
SD_D2: 02_ZYNQ_CORE_POS (J6.37), 03_ZYNQ_JTAG_BOOT (U5.1)
SD_D3: 02_ZYNQ_CORE_POS (J6.39), 03_ZYNQ_JTAG_BOOT (U5.3)
SD_SEL: 02_ZYNQ_CORE_POS (J6.19), 03_ZYNQ_JTAG_BOOT (R43.2)
STROBE_1: 02_ZYNQ_CORE_POS (J3.22), 06_ZYNQ_CAMERALINK (U20.26)
STROBE_2: 02_ZYNQ_CORE_POS (J3.116), 06_ZYNQ_CAMERALINK (U22.26)
STROBE_3: 02_ZYNQ_CORE_POS (J5.39), 07_ZYNQ_CAMERALINK (U27.47)
STROBE_4: 02_ZYNQ_CORE_POS (J6.105), 07_ZYNQ_CAMERALINK (U28.26)
SYS_RESET: 02_ZYNQ_CORE_POS (J5.117), 03_ZYNQ_JTAG_BOOT (C41.1 KEY1.1)
UART_RXD: 02_ZYNQ_CORE_POS (J6.7), 04_ZYNQ_MISC_INTERFACE (R59.1)
UART_TXD: 02_ZYNQ_CORE_POS (J6.9), 04_ZYNQ_MISC_INTERFACE (R60.1)